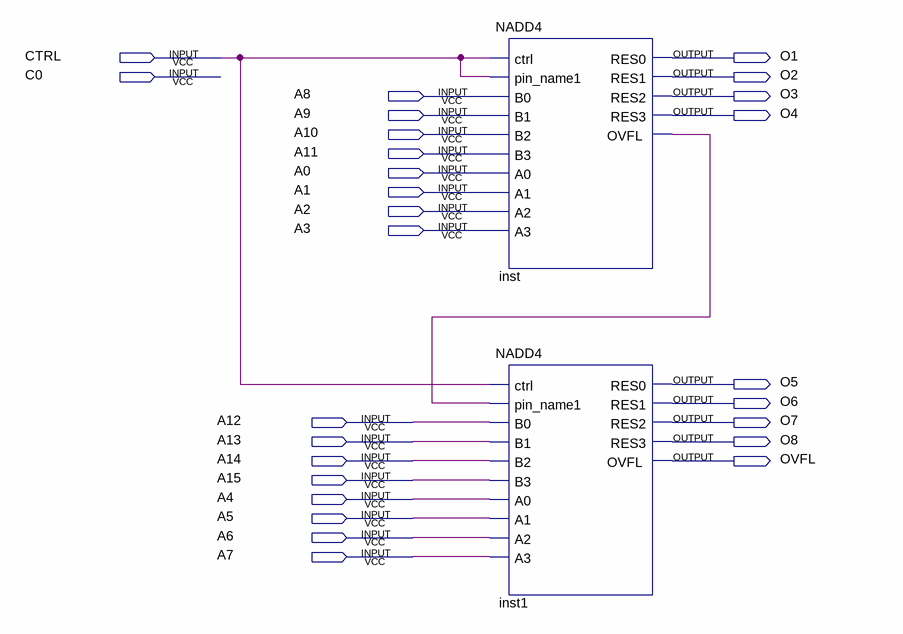
[diagram p0: schematic sheet]
// Quartus schematic exp3.bdf as structural Verilog: 2 symbols, 27 pins
module exp3 (
  input  CTRL,
  input  C0,
  input  A8,
  input  A9,
  input  A10,
  input  A11,
  input  A0,
  input  A1,
  input  A2,
  input  A3,
  input  A12,
  input  A13,
  input  A14,
  input  A15,
  input  A4,
  input  A5,
  input  A6,
  input  A7,
  output O1,
  output O2,
  output O3,
  output O4,
  output O5,
  output O6,
  output O7,
  output O8,
  output OVFL
);

  wire inst_ovfl;

  NADD4 inst (
    .ctrl(CTRL), .pin_name1(CTRL), .B0(A8), .B1(A9), .B2(A10), .B3(A11), .A0(A0), .A1(A1), .A2(A2), .A3(A3),
    .RES0(O1), .RES1(O2), .RES2(O3), .RES3(O4), .OVFL(inst_ovfl));
  NADD4 inst1 (
    .ctrl(CTRL), .pin_name1(inst_ovfl), .B0(A12), .B1(A13), .B2(A14), .B3(A15), .A0(A4), .A1(A5), .A2(A6),
    .A3(A7), .RES0(O5), .RES1(O6), .RES2(O7), .RES3(O8), .OVFL(OVFL));
endmodule
